# EAGLE design bGeigieNanoKit V1.0r4 (EAGLE 7.4.0)
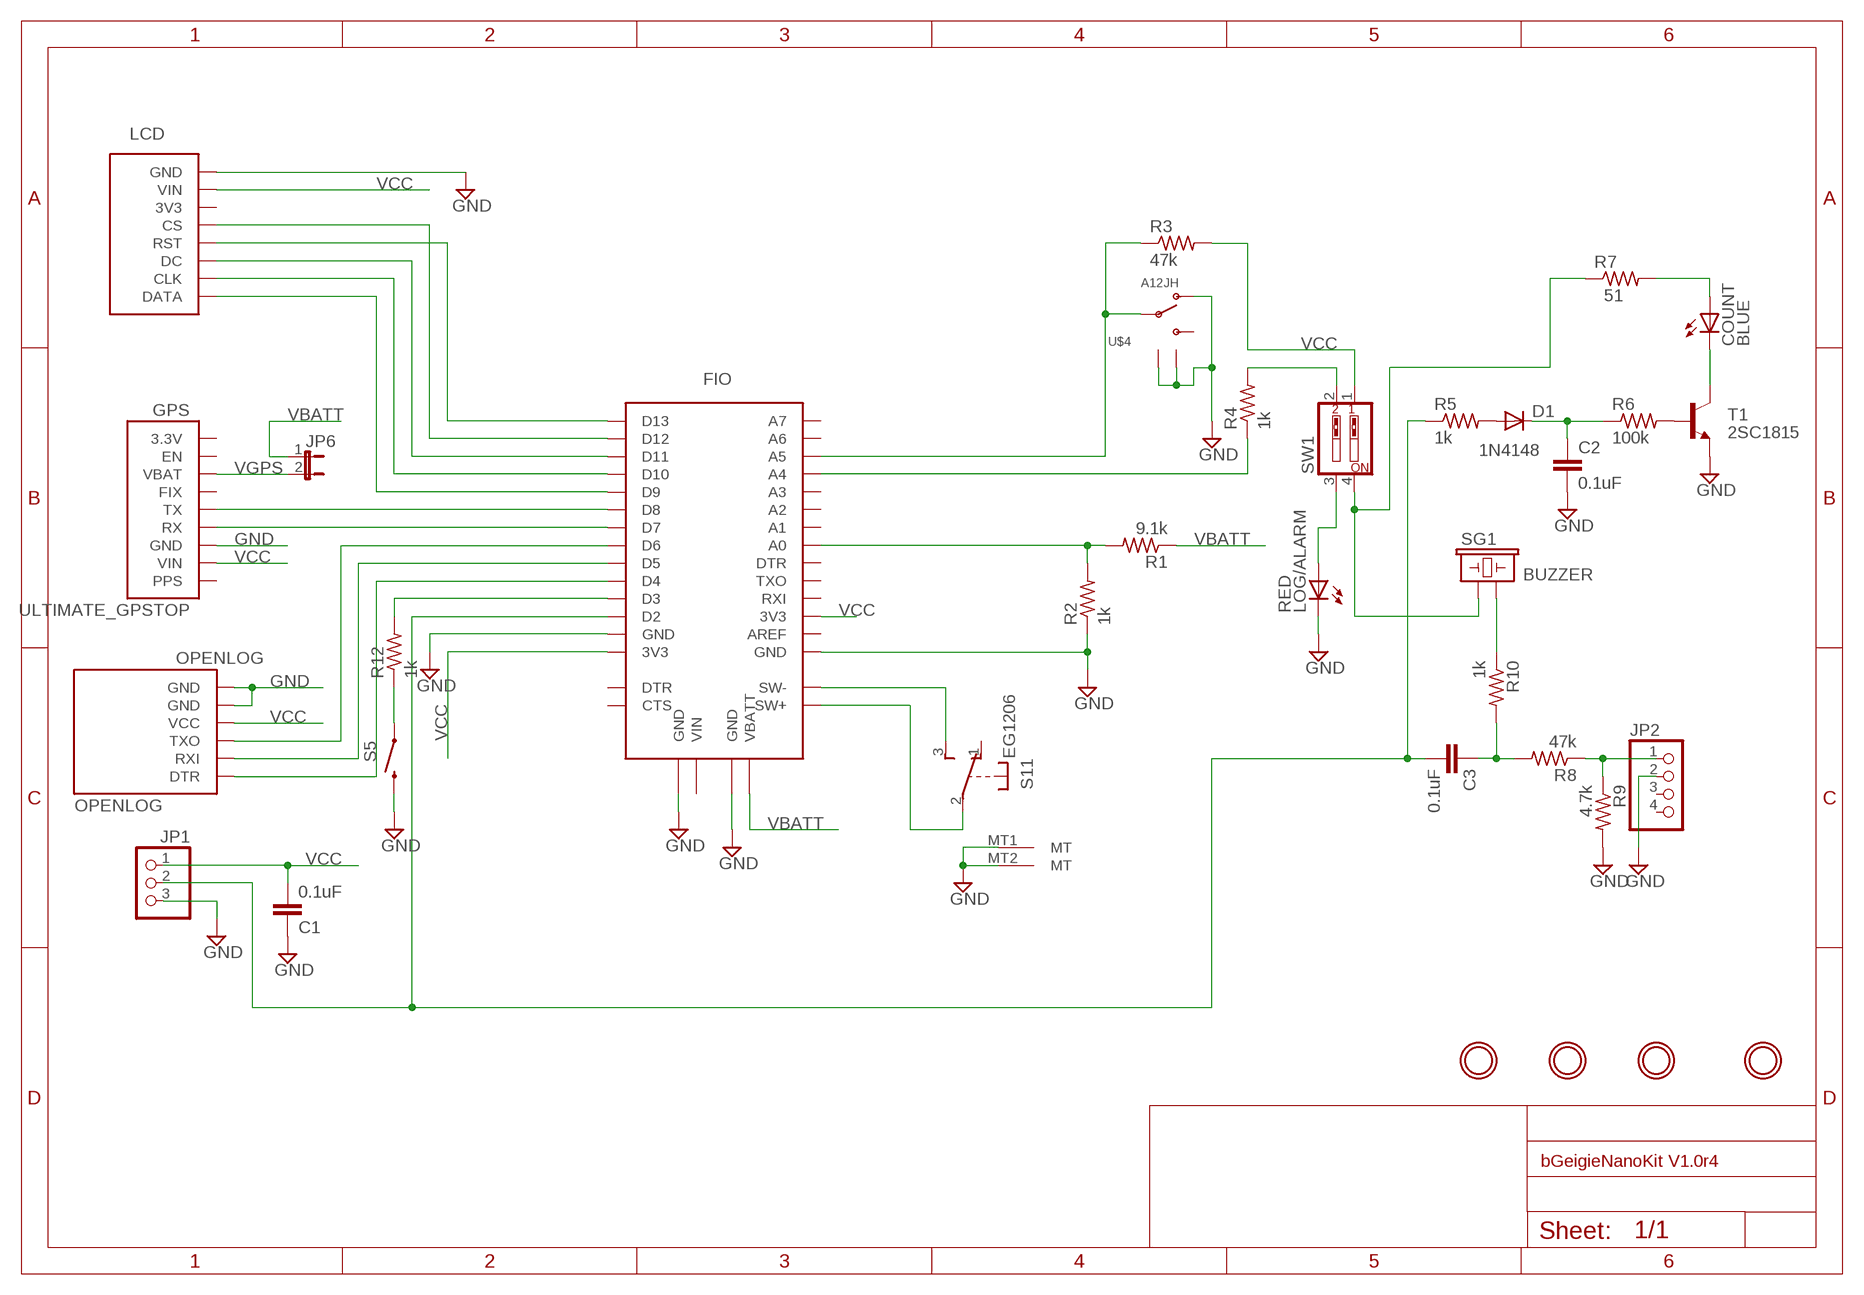
[diagram p0: schematic, sheet 1]

## Parts
C1  0.1uF  C-EU025-024X044  [C025-024X044]
C2  0.1uF  C-EU025-024X044  [C025-024X044]
C3  0.1uF  C-EU025-024X044  [C025-024X044]
COUNT  BLUE  LED3MM  [LED3MM]
D1  1N4148  1N4148DO35-7  [DO35-7]
FIO  FIO_SOCKETBOT  [FIO_V23_SOCKET_BOT]
GPS  ULTIMATE_GPSTOP  [ULTIMATE_GPS_V3_TOP]
JP1  PINHD-1X3/90  [1X03/90]
JP2  HEADER-1X4ROUND  [1X04_ROUND]
JP6  JUMPER-2SMD-NC  [SJ_2S]
LCD  SSD1306_128X64_V2_LCD1.3IN_LEVER  [SSD1306_128X64_1.3IN_LCD_LEVER]
LOG/ALARM  RED  LED3MM  [LED3MM]
OPENLOG  OPENLOG  [OPENLOG]
R1  9.1k  R-US_0207/10  [0207/10]
R2  1k  R-US_0207/10  [0207/10]
R3  47k  R-US_0207/10  [0207/10]
R4  1k  R-US_0207/10  [0207/10]
R5  1k  R-US_0207/10  [0207/10]
R6  100k  R-US_0207/10  [0207/10]
R7  51  R-US_0207/10  [0207/10]
R8  47k  R-US_0207/10  [0207/10]
R9  4.7k  R-US_0207/10  [0207/10]
R10  1k  R-US_0207/10  [0207/10]
R12  1k  R-US_0207/10  [0207/10]
S1  EG1206  [EG1206]
S5  SWITCH-MOMENTARY-2PTH  [TACTILE-PTH]
SG1  BUZZER  BUZZERPTH  [BUZZER-12MM]
SW1  SW_DIP-2  [EDG-02]
T1  2SC1815  [TO92-ECB]
U$4  A12JH  [A12AH]
U$6  MOUNTINGHOLE3.0THIN  [MOUNTINGHOLE_3.0_PLATEDTHIN]
U$7  MOUNTINGHOLE3.0THIN  [MOUNTINGHOLE_3.0_PLATEDTHIN]
U$8  MOUNTINGHOLE3.0THIN  [MOUNTINGHOLE_3.0_PLATEDTHIN]
U$9  MOUNTINGHOLE3.0THIN  [MOUNTINGHOLE_3.0_PLATEDTHIN]

## Nets
GND [PWP]: C1.1 C2.2 FIO.JP1$2(GND) FIO.JP2$1(GND) FIO.JP5$1(GND) FIO.JP6$1(GND) GPS.JP1$3(GND) GPS.U$8$P$1(GND) GPS.U$9$P$1(GND) JP1.3 JP2.2 LCD.JP1$8(GND) LCD.U$23$P$1(GND) LCD.U$26$P$1(GND) LOG/ALARM.K(C) OPENLOG.JP1$5(GND) OPENLOG.JP1$6(GND) R2.1 R9.2 S1.MT1(MT) S1.MT2(MT) S5.3 T1.E U$4.P$1 U$4.P$4(GND) U$4.P$5(GND)
N$1: FIO.JP1$10(D9) LCD.JP1$1(DATA)
N$2: FIO.JP1$11(D10) LCD.JP1$2(CLK)
N$3: FIO.JP1$12(D11) LCD.JP1$3(DC)
N$4: FIO.JP1$13(D12) LCD.JP1$5(CS)
N$5: FIO.JP1$14(D13) LCD.JP1$4(RST)
N$6: FIO.JP1$9(D8) GPS.JP1$5(TX)
N$7: FIO.JP1$8(D7) GPS.JP1$4(RX)
N$8: FIO.JP1$7(D6) OPENLOG.JP1$3(TXO)
N$9: FIO.JP1$6(D5) OPENLOG.JP1$2(RXI)
N$10: FIO.JP1$5(D4) OPENLOG.JP1$1(DTR)
N$11: FIO.JP5$7(A0) R1.2 R2.2
N$12 [HIGH_PWR]: FIO.JP7$2(SW+) S1.2(1:P)
N$13 [HIGH_PWR]: FIO.JP7$1(SW-) S1.3(1:S)
N$14: FIO.JP5$12(A5) R3.1 U$4.P$2
N$16: LOG/ALARM.A SW1.3
N$17: R4.2 SW1.2
N$18: C3.2 FIO.JP1$3(D2) JP1.2 R5.1
N$19: COUNT.A R7.2
N$20: R12.1 S5.1
N$22: COUNT.K(C) T1.C
N$23: R10.1 SG1.-
N$24: C3.1 R8.2 R10.2
N$25: JP2.1 R8.1 R9.1
N$26: D1.A R5.2
N$27: C2.1 D1.C R6.1
N$28: R6.2 T1.B
N$30: FIO.JP1$4(D3) R12.2
N$32: R7.1 SG1.+ SW1.4
N$33: FIO.JP5$11(A4) R4.1
VBATT: FIO.JP2$2(VBATT) JP6.1 R1.1
VCC [PWP]: C1.2 FIO.JP1$1(3V3) FIO.JP5$3(3V3) GPS.JP1$2(VIN) JP1.1 LCD.JP1$7(VIN) OPENLOG.JP1$4(VCC) R3.2 SW1.1
VGPS: GPS.JP1$7(VBAT) JP6.2
Unconnected: FIO.JP5$2(AREF) FIO.JP5$4(RXI) FIO.JP5$5(TXO) FIO.JP5$6(DTR) FIO.JP5$8(A1) FIO.JP5$9(A2) FIO.JP5$10(A3) FIO.JP5$13(A6) FIO.JP5$14(A7) FIO.JP6$2(VIN) FIO.JP8$1(CTS) FIO.JP9$1(DTR) GPS.JP1$1(PPS) GPS.JP1$6(FIX) GPS.JP1$8(EN) GPS.JP1$9(3.3V) JP2.3 JP2.4 LCD.JP1$6(3V3) S1.1(1:O) U$4.P$3

## Library data of the parts
C1-C3 = rcl:C-EU: CAPACITOR, European symbol
COUNT LOG/ALARM = adafruit:LED: LED OSRAM: - CHIPLED LG R971, LG N971, LY N971, LG Q971, LY Q971, LO R971, LY R971 LH N974, LH R974 LS Q976, LO Q976, LY Q976 LO Q996 - Hyper CHIPLED LW Q18S LB Q993, LB Q99A, LB R99A - SideLED LS A670, LO A670, LY A670, LG A670, LP A670 LB A673, LV A673, LT A673, LW A673 LH A674 LY A675 LS A676, LA A676, LO A676, LY A676, LW A676 LS A679, LY A679, LG A679 - Hyper Micro SIDELED® LS Y876, LA Y876, LO Y876, LY Y876 LT Y87S - SmartLED LW L88C, LW L88S LB L89C, LB L89S, LG L890 LS L89K, LO L89K, LY L89K LS L896, LA L896, LO L896, LY L896 - TOPLED LS T670, LO T670, LY T670, LG T670, LP T670 LSG T670, LSP T670, LSY T670, LOP T670, LYG T670 LG T671, LOG T671, LSG T671 LB T673, LV T673, LT T673, LW T673 LH T674 LS T676, LA T676, LO T676, LY T676, LB T676, LH T676, LSB T676, LW T676 LB T67C, LV T67C, LT T67C, LS T67K, LO T67K, LY T67K, LW E67C LS E67B, LA E67B, LO E67B, LY E67B, LB E67C, LV E67C, LT E67C LW T67C LS T679, LY T679, LG T679 LS T770, LO T770, LY T770, LG T770, LP T770 LB T773, LV T773, LT T773, LW T773 LH T774 LS E675, LA E675, LY E675, LS T675 LS T776, LA T776, LO T776, LY T776, LB T776 LHGB T686 LT T68C, LB T68C - Hyper Mini TOPLED® LB M676 - Mini TOPLED Santana® LG M470 LS M47K, LO M47K, LY M47K Source: http://www.osram.convergy.de/
D1 = diode:1N4148: DIODE high speed (Philips); D1: 1N4148
FIO = open_hw_sockets:FIO_SOCKET
GPS = open_hw_sockets:ULTIMATE_GPS
JP1 = pinhead:PINHD-1X3: PIN HEADER
JP2 = microbuilder:HEADER-1X4: PIN HEADER
JP6 = SparkFun:JUMPER-2: Jumper Basic 0.1" spaced jumper. Use with breakaway headers.
LCD = open_hw_sockets:SSD1306_128X64_V2_LCD
OPENLOG = open_hw_sockets:OPENLOG: Openlog
R1-R10 R12 = rcl:R-US_: RESISTOR, American symbol
S1 = open_hw_sockets:EG1206: E-Switch right-angle slide SPDT Part #EG1213 http://www.ladyada.net/library/eagle
S5 = SparkFun:SWITCH-MOMENTARY-2
SG1 = SparkFun-Electromechanical:BUZZER: Buzzer 12mm Spark Fun Electronics SKU : Comp-Buzzer
SW1 = special:SW_DIP-2: DIP SWITCH
T1 = transistor:2SC1815: NPN EPITAXIAL TRANSISTOR Source: TOSHIBA .. 2SC1815 1.pdf
U$4 = open_hw_sockets:A12JH
U$6-U$9 = microbuilder:MOUNTINGHOLE: Mounting Hole For #2 screws (0.086"/2.18mm width, 0.094"/2.4mm hole) use 2.5mm

## Net classes
0 default: width 0.406 mm, drill 0.254 mm, clearance 0.305 mm
1 PWP: width 0.813 mm, drill 0.254 mm, clearance 0.305 mm
2 HIGH_PWR: width 1.422 mm, drill 0.508 mm, clearance 0.406 mm

## Board
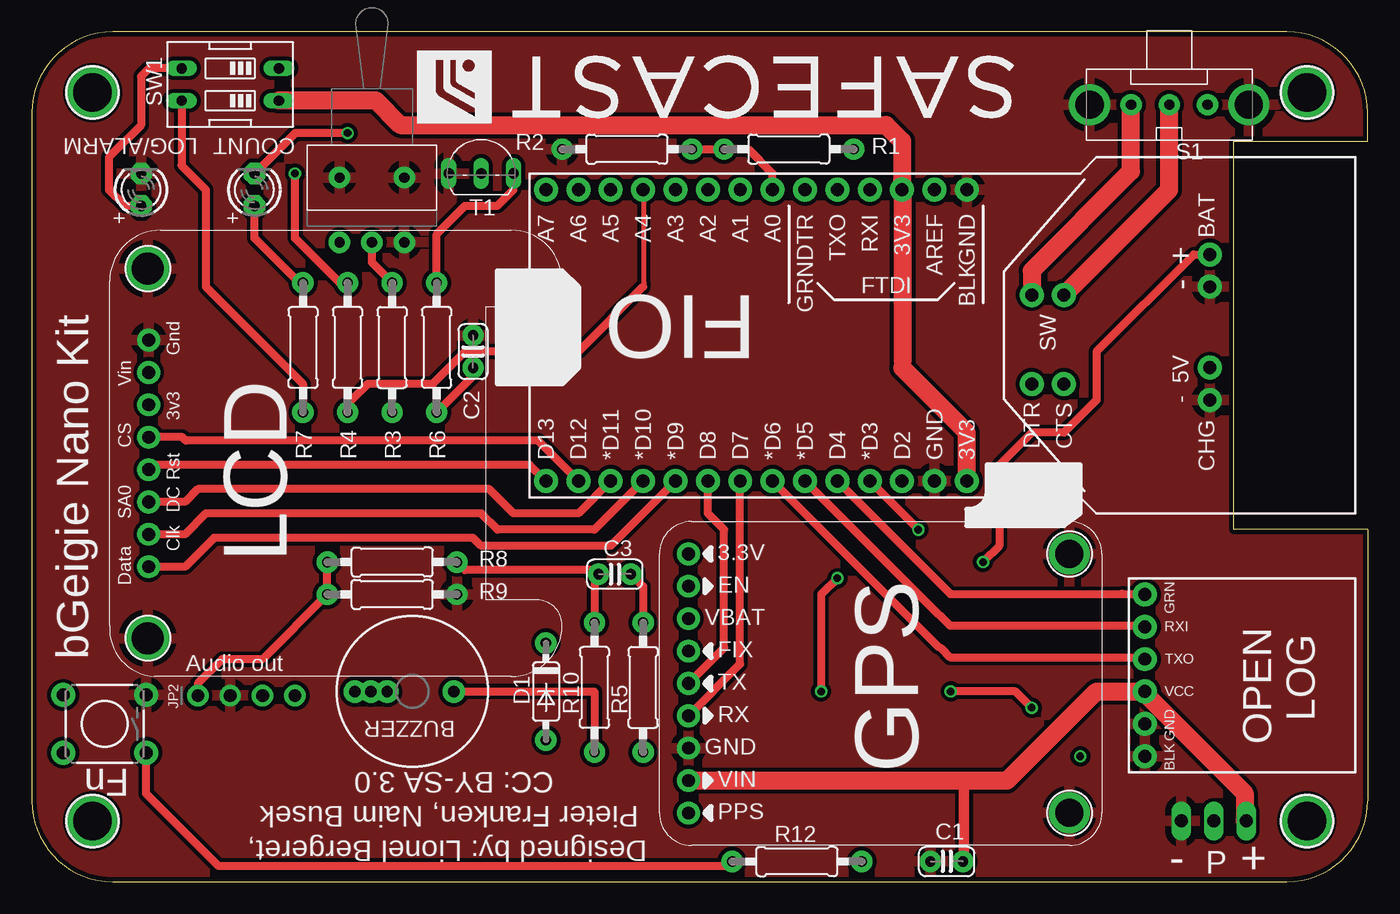
[diagram p1: board, top side]
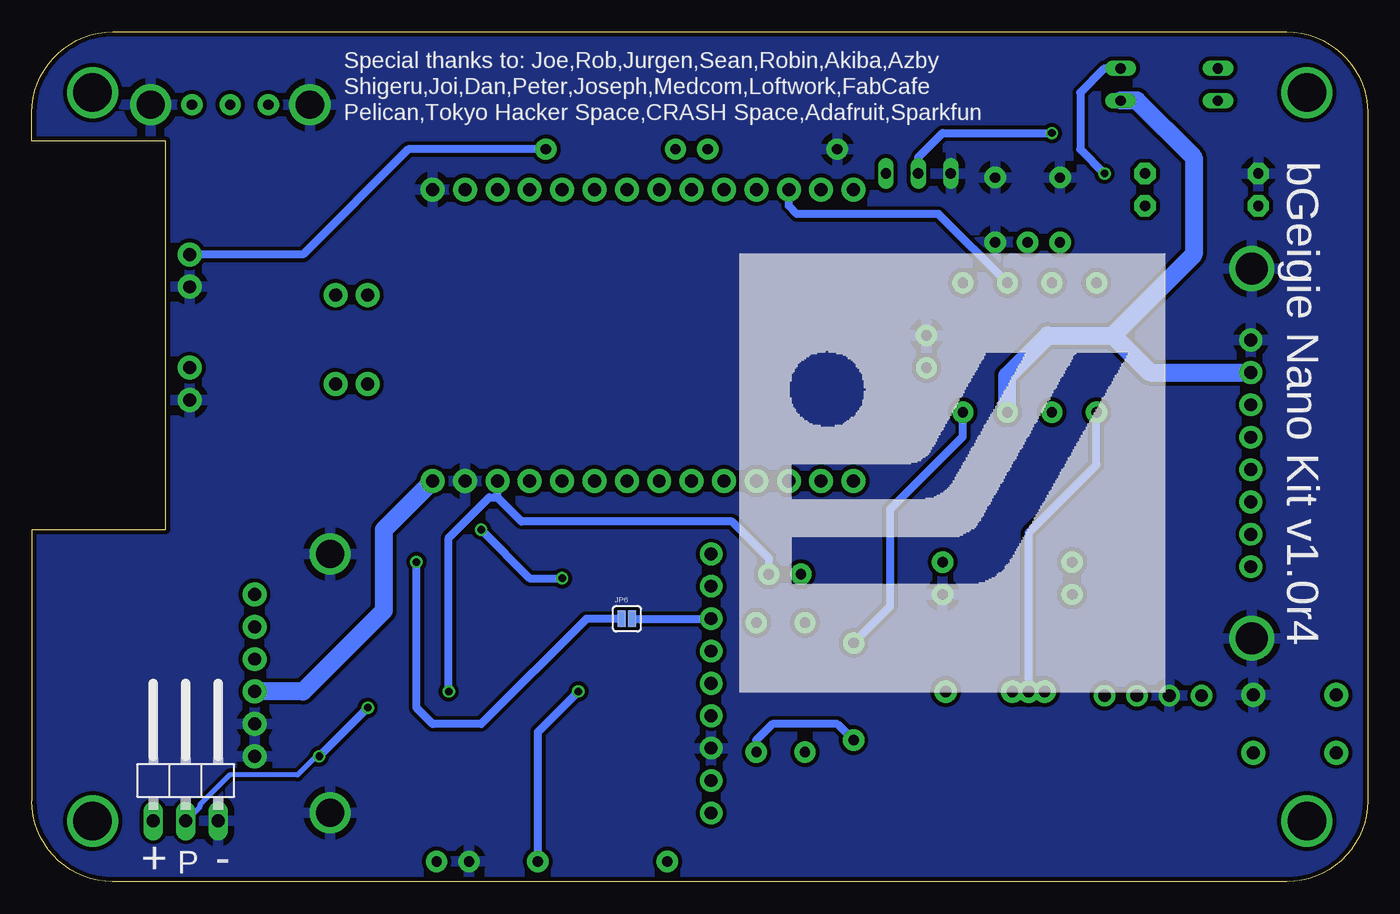
[diagram p2: board, bottom side, seen from below]

Size 104.77 x 66.67 mm. Coordinates in mm from the lower left corner, seen from the top.
Outline: 0,60.33 0,6.35 arc90 6.35,0 98.43,0 arc90 104.77,6.35 104.77,27.62 94.3,27.62 94.3,58.1 104.77,58.1 104.77,60.33 arc90 98.43,66.68 6.35,66.68 arc90 0,60.33
Copper layers (1*16): Top 0.0356mm / dielectric 1.5011mm / Bottom 0.0356mm
Design rules "LaenPCBOrder *": minimum track width 6mil, minimum drill 13mil, track to track 6mil, track to pad 6mil, pad to pad 6mil, via to via 6mil, smd to smd 6mil, copper to edge 15mil, drill to drill 6mil, minimum pad ring 7mil, minimum via ring 7mil, stop-mask expansion 4mil, vias tented up to drill 0mil, thermal gap 20mil

### Footprints (pad centres in the part's own frame; a part is rotated, then mirrored left to right if it is on the bottom)
C025-024X044 = drill 0.813 pad 1.676: 1 -1.27,0; 2 1.27,0
LED3MM = drill 0.813 pad 1.676 octagon: A -1.27,0; K 1.27,0
DO35-7 = drill 0.813 pad 1.676: A 3.81,0; C -3.81,0
FIO_V23_SOCKET_BOT = drill 1.016 pad 1.88: JP1$1 1.27,34.29; JP1$2 1.27,31.75; JP1$3 1.27,29.21; JP1$4 1.27,26.67; JP1$5 1.27,24.13; JP1$6 1.27,21.59; JP1$7 1.27,19.05; JP1$8 1.27,16.51; JP1$9 1.27,13.97; JP1$10 1.27,11.43; JP1$11 1.27,8.89; JP1$12 1.27,6.35; JP1$13 1.27,3.81; JP1$14 1.27,1.27; JP2$1 16.51,53.34; JP2$2 19.05,53.34; JP5$1 24.13,34.29; JP5$2 24.13,31.75; JP5$3 24.13,29.21; JP5$4 24.13,26.67; JP5$5 24.13,24.13; JP5$6 24.13,21.59; JP5$7 24.13,19.05; JP5$8 24.13,16.51; JP5$9 24.13,13.97; JP5$10 24.13,11.43; JP5$11 24.13,8.89; JP5$12 24.13,6.35; JP5$13 24.13,3.81; JP5$14 24.13,1.27; JP6$1 7.62,53.34; JP6$2 10.16,53.34; JP7$1 15.875,39.37; JP7$2 15.875,41.91; JP8$1 8.89,41.91; JP9$1 8.89,39.37
ULTIMATE_GPS_V3_TOP = drill 1 pad 1.778: JP1$1 22.86,2.286; JP1$2 20.32,2.286; JP1$3 17.78,2.286; JP1$4 15.24,2.286; JP1$5 12.7,2.286; JP1$6 10.16,2.286; JP1$7 7.62,2.286; JP1$8 5.08,2.286; JP1$9 2.54,2.286 | drill 2.2 pad 3: U$8$P$1 2.54,32.182; U$9$P$1 22.86,32.182
1X03/90 = drill 1.016 long: 1 -2.54,-3.81; 2 0,-3.81; 3 2.54,-3.81
1X04_ROUND = drill 1 pad 1.676: 1 -3.81,0; 2 -1.27,0; 3 1.27,0; 4 3.81,0
SJ_2S = smd 0.635 x 1.27: 1 -0.412,0; 2 0.412,0
SSD1306_128X64_1.3IN_LCD_LEVER = drill 1 pad 1.778: JP1$1 8.61,32.43; JP1$2 11.15,32.43; JP1$3 13.69,32.43; JP1$4 16.23,32.43; JP1$5 18.77,32.43; JP1$6 21.31,32.43; JP1$7 23.85,32.43; JP1$8 26.39,32.43 | drill 2.5 pad 3.2: U$23$P$1 32,32.5; U$26$P$1 3,32.5
OPENLOG = drill 1.016 pad 1.88: JP1$1 1.27,1.27; JP1$2 3.81,1.27; JP1$3 6.35,1.27; JP1$4 8.89,1.27; JP1$5 11.43,1.27; JP1$6 13.97,1.27
0207/10 = drill 0.813 pad 1.676: 1 -5.08,0; 2 5.08,0
EG1206 = drill 0.8 pad 1.676: 1 -3,0; 2 0,0; 3 3,0 | drill 2.2 pad 3: MT1 -6.25,0; MT2 6.25,0
TACTILE-PTH = drill 1.016 pad 1.88: 1 -3.251,2.261; 2 3.251,2.261; 3 -3.251,-2.261; 4 3.251,-2.261
BUZZER-12MM = drill 0.9 pad 1.778: + 3.25,0; +1 4.52,0; +2 3.25,0; +3 1.98,0; - -3.25,0
EDG-02 = drill 0.813 long: 1 -1.27,-3.81; 2 1.27,-3.81; 3 1.27,3.81; 4 -1.27,3.81
TO92-ECB = drill 0.813 long: B 2.54,0; C 0,0; E -2.54,0
A12AH = drill 0.8 pad 1.676: P$1 -2.54,5.08; P$2 0,5.08; P$3 2.54,5.08; P$4 -2.54,0; P$5 2.54,0
MOUNTINGHOLE_3.0_PLATEDTHIN = drill 3 pad 3.6: P$1 0,0

### Placement (x,y rotation side)
C1  71.75,1.59 0 top
C2  34.61,41.59 90 top
C3  45.72,24.13 0 top
COUNT  17.46,54.29 90 top
D1  40.32,14.92 270 top
FIO  39.05,30.16 90 bottom
GPS  49.21,28.26 270 top
JP1  92.71,8.57 0 bottom
JP2  16.83,14.6 0 top
JP6  58.1,20.64 0 bottom
LCD  41.59,16.1 90 top
LOG/ALARM  8.57,54.29 90 top
OPENLOG  86.04,23.81 270 top
R1  59.37,57.47 180 top
R2  46.67,57.47 0 top
R3  28.26,41.91 270 top
R4  24.77,41.91 90 top
R5  47.94,15.24 270 top
R6  31.75,41.91 90 top
R7  21.27,41.91 90 top
R8  28.26,25.08 0 top
R9  28.26,22.54 0 top
R10  44.13,15.24 90 top
R12  60.01,1.59 0 top
S1  89.22,60.96 180 top
S5  5.71,12.38 180 top
SG1  29.85,14.92 180 top
SW1  15.56,62.55 90 top
T1  35.24,55.56 0 top
U$1  [SAFECAST_LOGO4]  49.21,49.21 270 bottom
U$4  26.67,55.25 180 top
U$5  [SAFECAST_LOGO2]  77.6,65.72 180 top
U$6  100.01,61.91 0 top
U$7  100.01,4.76 0 top
U$8  4.76,4.76 0 top
U$9  4.76,61.91 0 top

### Tracks (layer width: path | path; a pad name or v marks a point on that pad's centre or on a via)
GND
  pour Bottom (isolate 0.305): -1.59,-1.59 106.36,-1.59 106.36,68.26 -1.59,68.26
  pour Top (isolate 0.305): -1.59,-1.59 106.36,-1.59 106.36,68.26 -1.59,68.26
N$1
  Top 0.61: FIO.JP1$10 45.4,26.35 35.24,26.35 34.61,26.99 14.29,26.99 12.01,24.71 LCD.JP1$1
N$2
  Top 0.61: FIO.JP1$11 44.13,27.62 36.51,27.62 35.24,28.89 13.65,28.89 12.01,27.25 LCD.JP1$2
N$3
  Top 0.61: FIO.JP1$12 42.86,28.89 37.78,28.89 35.88,30.8 13.02,30.8 12.01,29.79 LCD.JP1$3
N$4
  Top 0.61: FIO.JP1$13 39.69,34.61 12.06,34.61 11.8,34.87 LCD.JP1$5
N$5
  Top 0.61: FIO.JP1$14 39.05,32.7 9.53,32.7 LCD.JP1$4
N$6
  Top 0.61: GPS.JP1$5 54.29,18.35 54.29,27.62 53.02,28.89 FIO.JP1$9
N$7
  Top 0.61: GPS.JP1$4 55.56,17.08 FIO.JP1$8
N$8
  Top 0.406: 87.31,17.61 OPENLOG.JP1$3 | 71.31,18.33 71.12,18.42
  Top 0.61: FIO.JP1$7 71.12,18.42 | 87.31,17.61 72.02,17.61 71.31,18.33
N$9
  Top 0.406: 87.31,20.1 OPENLOG.JP1$2 | 71.31,20.82 71.12,20.96
  Top 0.61: FIO.JP1$6 71.12,20.96 | 87.31,20.1 72.02,20.1 71.31,20.82
N$10
  Top 0.406: 87.31,22.59 OPENLOG.JP1$1 | 85.53,22.59 85.41,22.54
  Top 0.61: FIO.JP1$5 72.07,22.54 85.41,22.54 | 85.53,22.59 87.31,22.59
N$11
  Top 0.61: FIO.JP5$7 58.1,55.56 56.2,57.47 R1.2 R2.2
N$12
  Top 1.422: FIO.JP7$2 89.22,54.29 S1.2
N$13
  Top 1.422: FIO.JP7$1 78.42,47.94 86.22,55.74 S1.3
N$14
  Top 0.61: R3.1 26.67,48.58 U$4.P$2
  Bottom 0.61: R3.1 33.65,52.39 44.77,52.39 45.4,53.02 FIO.JP5$12
N$15
  Bottom 0.61: 25.08,14.92 27.62,14.92
N$16
  Top 0.61: SW1.3 9.21,63.82 8.57,63.18 8.57,59.37 6.03,56.83 6.03,54.29 7.3,53.02 LOG/ALARM.A
N$17  (via drill 0.6)
  Top 0.61: v20.64,55.56 20.64,50.48 24.13,46.99 R4.2
  Bottom 0.61: SW1.2 20.64,63.82 22.54,61.91 22.54,57.47 v20.64,55.56
N$18  (via drill 0.6)
  Top 0.61: v78.42,13.65 77.15,14.92 v72.07,14.92 | C3.2 47.94,23.18 R5.1
  Bottom 0.406: JP1.2 92.65,4.81 91.58,5.88 91.58,6.06 89.27,8.37 83.93,8.37 82.51,9.79 v82.23,9.84
  Bottom 0.61: 68.26,30.16 FIO.JP1$3 | v82.23,9.84 v78.42,13.65 | v72.07,14.92 72.07,26.99 68.9,30.16 68.26,30.16 | 68.26,30.16 66.36,28.26 49.85,28.26 46.99,25.4 C3.2
N$19
  Top 0.61: R7.2 20.96,46.99 17.46,50.48 COUNT.A
N$20
  Top 0.61: R12.1 54.61,1.27 14.6,1.27 8.97,6.91 S5.1
N$22  (via drill 0.6)
  Top 0.61: COUNT.K 20.64,58.74 v24.76,58.74
  Bottom 0.61: T1.C 35.24,56.83 33.34,58.74 v24.76,58.74
N$23
  Top 0.61: SG1.- 44.13,14.92 R10.1
N$24
  Top 0.61: R8.2 33.97,24.45 44.13,24.45 C3.1 44.13,23.81 R10.2
N$25
  Top 0.61: R8.1 R9.1 18.1,17.46 14.92,17.46 13.02,15.56 JP2.1
N$26
  Bottom 0.61: R5.2 47.94,11.11 46.67,12.38 41.59,12.38 D1.A
N$27
  Top 0.61: C2.1 34.61,39.69 R6.1
  Bottom 0.61: R6.1 31.75,34.93 37.47,29.21 37.47,21.59 D1.C
N$28
  Top 0.61: R6.2 31.75,50.8 33.97,53.02 36.51,53.02 37.78,54.29 T1.B
N$30  (via drill 0.6)
  Top 0.61: FIO.JP1$4 v69.53,27.62 | v63.18,23.81 61.91,22.54 v61.91,14.92
  Bottom 0.61: v69.53,27.62 65.72,23.81 v63.18,23.81 | R12.2 65.09,11.75 v61.91,14.92
N$32
  Top 0.61: SW1.4 11.75,56.2 13.65,54.29 13.65,46.67 21.27,39.05 R7.1
  Bottom 0.61: R7.1 21.27,32.7 26.6,27.38 SG1.+
N$33
  Top 0.406: FIO.JP5$11 48.02,54.24 48.02,46.95 47.94,46.67
  Top 0.61: 47.94,46.67 42.86,41.59 33.97,41.59 31.43,39.05 26.35,39.05 24.76,37.47 R4.1
VBATT  (via drill 0.6)
  Top 0.61: v74.61,25.08 75.88,26.35 75.88,32.7 78.42,35.24 80.96,35.24 83.5,37.78 83.5,41.59 91.12,49.21 FIO.JP2$2
  Bottom 0.61: JP6.1 61.28,20.64 69.53,12.38 73.34,12.38 74.61,13.65 v74.61,25.08 | R1.1 75.25,57.47 83.5,49.21 FIO.JP2$2
VCC
  Top 0.813: 68.29,40.91 68.26,40.32 | 68.29,53.71 FIO.JP5$3 | 73.09,7.94 73.09,1.61 C1.2 | 95.14,4.81 JP1.1 | 87.67,14.41 OPENLOG.JP1$4
  Top 1.422: FIO.JP5$3 68.26,58.1 66.99,59.37 28.89,59.37 26.99,61.28 SW1.1 | FIO.JP1$1 73.34,35.24 68.26,40.32 | 68.29,53.71 68.29,40.91 | GPS.JP1$2 73.09,7.94 76.52,7.94 83.5,14.92 OPENLOG.JP1$4 | 95.14,4.81 95.14,6.95 87.67,14.41
  Bottom 1.422: R3.2 28.26,39.69 25.08,42.86 20,42.86 | FIO.JP1$1 77.15,27.62 77.15,21.27 83.5,14.92 OPENLOG.JP1$4 | SW1.1 18.1,61.28 13.65,56.83 13.65,49.21 20,42.86 | 20,42.86 17.09,39.95 LCD.JP1$7
VGPS
  Bottom 0.61: JP6.2 GPS.JP1$7

### Text on the board
tPlace: FIO | LCD | bGeigie Nano Kit | Audio out | OPEN / LOG | Fn | GPS | + | Designed by: Lionel Bergeret, / Pieter Franken, Naim Busek / CC: BY-SA 3.0 | - | P
bPlace: Special thanks to: Joe,Rob,Jurgen,Sean,Robin,Akiba,Azby / Shigeru,Joi,Dan,Peter,Joseph,Medcom,Loftwork,FabCafe / Pelican,Tokyo Hacker Space,CRASH Space,Adafruit,Sparkfun | bGeigie Nano Kit v1.0r4 | - | P | +